# Altium schematic sheet CPU.SchDoc
size A4
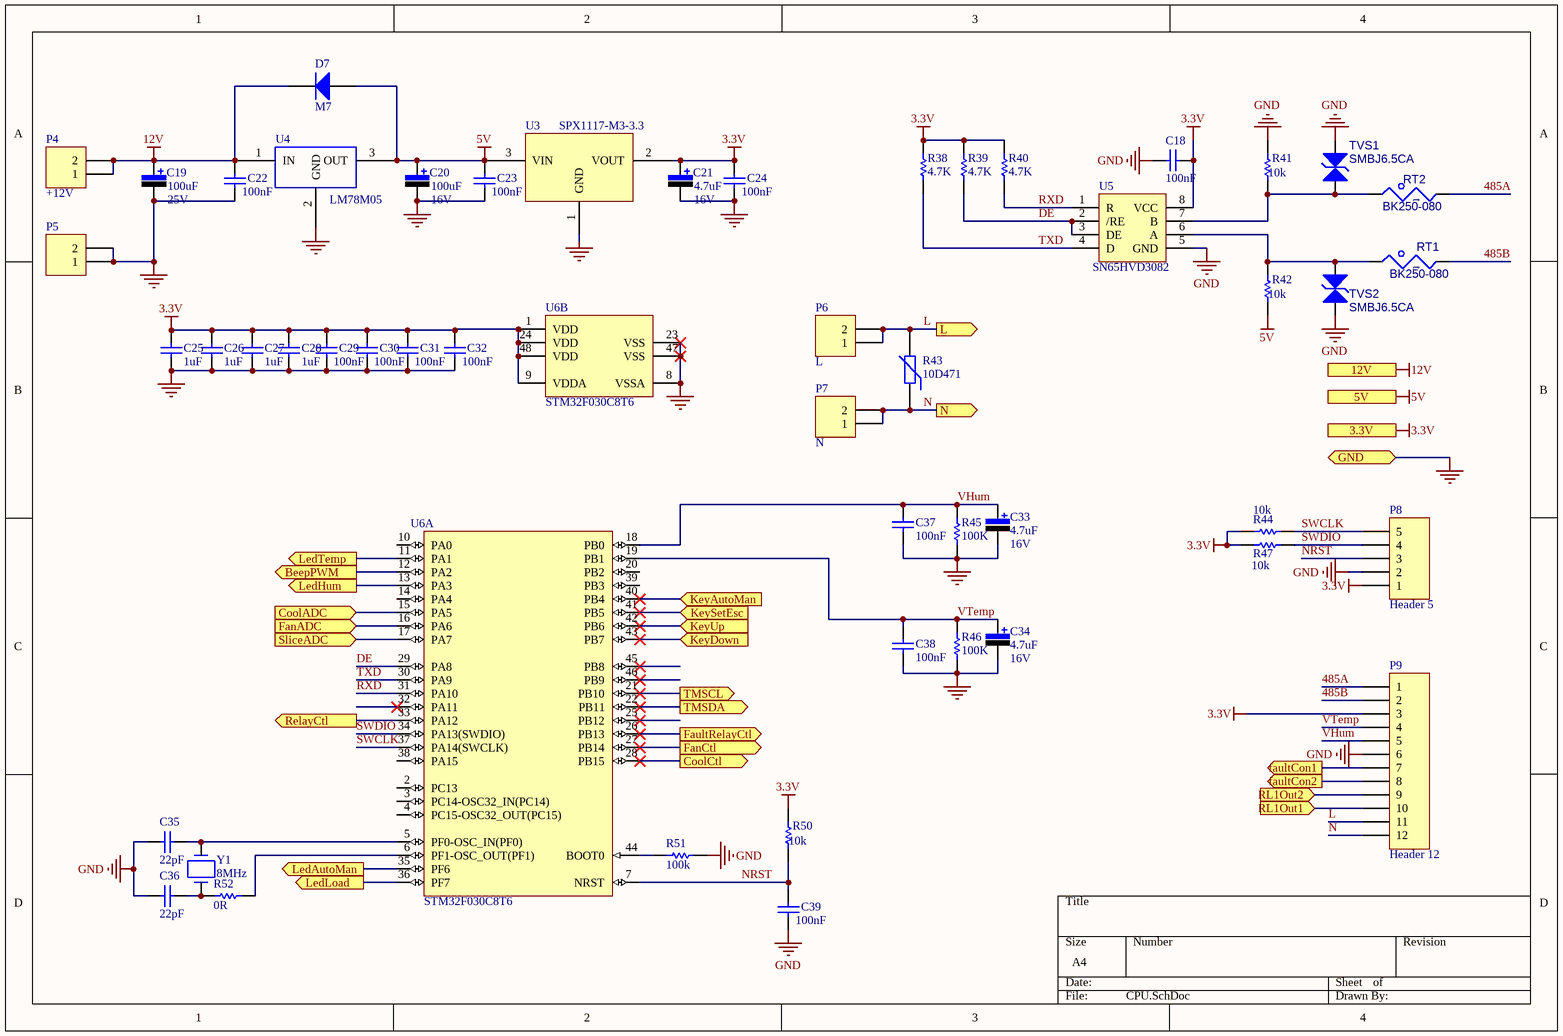
[diagram p0: CPU.SchDoc]

## Parts
C18  100nF (104) 10% 50V  [0603_C]  (value not drawn)
C19  value 100uF  Vol: 25V  [C-RB-8]  (hidden comment: 100uF/25V)
C20  value 100uF  Vol: 16V  [C-RB-8]  (hidden comment: 100uF/16V)
C21  value 4.7uF  Vol: 16V  [CAP-1206]  (hidden comment: 4.7uF/16V)
C22  100nF (104) 10% 50V  [0603_C]  (value not drawn)
C23  100nF (104) 10% 50V  [0603_C]  (value not drawn)
C24  100nF (104) 10% 50V  [0603_C]  (value not drawn)
C25  1uF (105) 10% 50V  [0603_C]  (value not drawn)
C26  1uF (105) 10% 50V  [0603_C]  (value not drawn)
C27  1uF (105) 10% 50V  [0603_C]  (value not drawn)
C28  1uF (105) 10% 50V  [0603_C]  (value not drawn)
C29  100nF (104) 10% 50V  [0603_C]  (value not drawn)
C30  100nF (104) 10% 50V  [0603_C]  (value not drawn)
C31  100nF (104) 10% 50V  [0603_C]  (value not drawn)
C32  100nF (104) 10% 50V  [0603_C]  (value not drawn)
C33  value 4.7uF  Vol: 16V  [CAP-1206]  (hidden comment: 4.7uF/16V)
C34  value 4.7uF  Vol: 16V  [CAP-1206]  (hidden comment: 4.7uF/16V)
C35  22pF (220) 5% 50V  [0603_C]  (value not drawn)
C36  22pF (220) 5% 50V  [0603_C]  (value not drawn)
C37  100nF (104) 10% 50V  [0603_C]  (value not drawn)
C38  100nF (104) 10% 50V  [0603_C]  (value not drawn)
C39  100nF (104) 10% 50V  [0603_C]  (value not drawn)
D7  M7  [DO214AC-SMA]
P4  +12V  [ConSlice0.5]
P5  (no value)  [ConSlice0.5]
P6  L  [ConSlice0.5]
P7  N  [ConSlice0.5]
P8  Header 5  [HDR1X5]
P9  Header 12  [HDR3.5-12P_1]
R38  4.7K  [RESC1608N-R0603]
R39  4.7K  [RESC1608N-R0603]
R40  4.7K  [RESC1608N-R0603]
R41  10k  [RESC1608N-R0603]
R42  10k  [RESC1608N-R0603]
R43  10D471  [10D471K]
R44  10k  [RESC1608N-R0603]
R45  100K  [RESC1608N-R0603]
R46  100K  [RESC1608N-R0603]
R47  10k  [RESC1608N-R0603]
R50  10k  [RESC1608N-R0603]
R51  100k  [RESC1608N-R0603]
R52  0R  [RESC1608N-R0603]
RT1  BK250-080  [RAD0.2]
RT2  BK250-080  [RAD0.2]
TVS1  SMBJ6.5CA  [1812]
TVS2  SMBJ6.5CA  [1812]
U3  SPX1117-M3-3.3  [SOT223]
U4  LM78M05  [DPAK]
U5  SN65HVD3082  [SO-8]
U6  STM32F030C8T6  [STM-LQFP48_N]  (parts A,B of 2)
Y1  8MHz  [HC49S_th]

## Ports
3.3V (out), 5V (out), 12V (out), BeepPWM (out), CoolADC (in), CoolCtl (out), FanADC (in), FanCtl (out), faultCon1 (out), faultCon2 (out), FaultRelayCtl (out), GND (bidir), KeyAutoMan (in), KeyDown (in), KeySetEsc (in), KeyUp (in), L (out), LedAutoMan (out), LedHum (out), LedLoad (out), LedTemp (out), N (out), RelayCtl (out), RL1Out1 (in), RL1Out2 (in), SliceADC (in), TMSCL (out), TMSDA (out)

## Nets
3.3V: C18.1 C21.1 C24.2 C25.2 C26.2 C27.2 C28.2 C29.2 C30.2 C31.2 C32.2 P8.1 P9.3 R38.1 R39.1 R40.1 R44.1 R47.1 R50.1 U3.2(VOUT) U5.8(VCC) U6.1(VDD) U6.9(VDDA) U6.24(VDD) U6.48(VDD) ; port 3.3V
5V: C20.1 C23.2 D7.1(A) R42.2 U3.3(VIN) U4.3(OUT) ; port 5V
12V: C19.1 C22.2 D7.2(K) P4.1 P4.2 U4.1(IN) ; port 12V
GND: C18.2 C19.2 C20.2 C21.2 C22.1 C23.1 C24.1 C25.1 C26.1 C27.1 C28.1 C29.1 C30.1 C31.1 C32.1 C33.2 C34.2 C35.2 C36.2 C37.1 C38.1 C39.1 P5.1 P5.2 P8.2 P9.6 R41.1 R45.2 R46.2 R51.2 TVS1.1(A) TVS2.2(K) U3.1(GND) U4.2(GND) U5.5(GND) U6.8(VSSA) U6.23(VSS) U6.47(VSS) ; port GND
485A: P9.1 RT2.1
485B: P9.2 RT1.1
BeepPWM: U6.12(PA2) ; port BeepPWM
CoolADC: U6.15(PA5) ; port CoolADC
CoolCtl: U6.28(PB15) ; port CoolCtl
DE: R39.2 U5.2(/RE) U5.3(DE) U6.29(PA8)
FanADC: U6.16(PA6) ; port FanADC
FanCtl: U6.27(PB14) ; port FanCtl
faultCon1: P9.7 ; port faultCon1
faultCon2: P9.8 ; port faultCon2
FaultRelayCtl: U6.26(PB13) ; port FaultRelayCtl
KeyAutoMan: U6.40(PB4) ; port KeyAutoMan
KeyDown: U6.43(PB7) ; port KeyDown
KeySetEsc: U6.41(PB5) ; port KeySetEsc
KeyUp: U6.42(PB6) ; port KeyUp
L: P6.1 P6.2 P9.11 R43.2 ; port L
LedAutoMan: U6.35(PF6) ; port LedAutoMan
LedHum: U6.13(PA3) ; port LedHum
LedLoad: U6.36(PF7) ; port LedLoad
LedTemp: U6.11(PA1) ; port LedTemp
N: P7.1 P7.2 P9.12 R43.1 ; port N
NRST: C39.2 P8.3 R50.2 U6.7(NRST)
RelayCtl: U6.33(PA12) ; port RelayCtl
RL1Out1: P9.10 ; port RL1Out1
RL1Out2: P9.9 ; port RL1Out2
RXD: R40.2 U5.1(R) U6.31(PA10)
SliceADC: U6.17(PA7) ; port SliceADC
SWCLK: P8.5 R44.2 U6.37(PA14(SWCLK))
SWDIO: P8.4 R47.2 U6.34(PA13(SWDIO))
TMSCL: U6.21(PB10) ; port TMSCL
TMSDA: U6.22(PB11) ; port TMSDA
TXD: R38.2 U5.4(D) U6.30(PA9)
VHum: C33.1 C37.2 P9.5 R45.1 U6.18(PB0)
VTemp: C34.1 C38.2 P9.4 R46.1 U6.19(PB1)
NetC35_1: C35.1 U6.5(PF0-OSC_IN(PF0)) Y1.1
NetC36_1: C36.1 R52.2 Y1.2
NetR41_2: R41.2 RT2.2 TVS1.2(K) U5.7(B)
NetR42_1: R42.1 RT1.2 TVS2.1(A) U5.6(A)
NetR51_1: R51.1 U6.44(BOOT0)
NetR52_1: R52.1 U6.6(PF1-OSC_OUT(PF1))

Not connected (* = marked no-connect by the designer): U6 2(PC13) 3(PC14-OSC32_IN(PC14)) 4(PC15-OSC32_OUT(PC15)) 10(PA0) 14(PA4) 20(PB2) 25(PB12)* 32(PA11)* 38(PA15) 39(PB3) 45(PB8)* 46(PB9)*

## Notes on the sheet
- (in symbol 0603 1uF (105) 10% 50V) 1uF
- (in symbol 0603 22pF (220) 5% 50V) 22pF
- (in symbol 0603 100nF (104) 10% 50V) 100nF
- (in symbol PTC-Thermistor) t

## Library data of the parts
C18 C22-C24 C29-C32 C37-C39 = 0603 100nF (104) 10% 50V: 贴片电容; ComponentLink1Description: 供应商链接; ComponentLink1URL: http://www.szlcsc.com/product/details_15331.html; Package: 0603; Supplier: LC; SuppliersPartNumber: C14663
C19 C20 = Cap Pol: Published: 8-Jun-2000; LatestRevisionDate: 17-Jul-2002; LatestRevisionNote: Re-released for DXP Platform.; PackageReference: RB7.6-15; Publisher: Altium Limited
C21 C33 C34 = Cap Pol: 4.7uF/16V钽电容; Published: 8-Jun-2000; LatestRevisionDate: 17-Jul-2002; LatestRevisionNote: Re-released for DXP Platform.; PackageReference: RB7.6-15; Publisher: Altium Limited
C25-C28 = 0603 1uF (105) 10% 50V: 贴片电容; ComponentLink1Description: 供应商链接; ComponentLink1URL: http://www.szlcsc.com/product/details_16531.html; Package: 0603; Supplier: LC; SuppliersPartNumber: C15849
C35 C36 = 0603 22pF (220) 5% 50V: 贴片电容; ComponentLink1Description: 供应商链接; ComponentLink1URL: http://www.szlcsc.com/product/details_2005.html; Package: 0603; Supplier: LC; SuppliersPartNumber: C1653
D7 = Diode: 二极管; Published: 8-Jun-2000; LatestRevisionDate: 17-Jul-2002; LatestRevisionNote: Re-released for DXP Platform.; PackageDocument: Sep-1996; PackageReference: SMC; Publisher: Altium Limited; Code_JEDEC: DO-214-AB; Type: M7
P4-P7 = Header 2: Header, 2-Pin; LatestRevisionDate: 17-Jul-2002; LatestRevisionNote: Re-released for DXP Platform.; Publisher: Altium Limited
P8 = Header 5: Header, 5-Pin; LatestRevisionDate: 17-Jul-2002; LatestRevisionNote: Re-released for DXP Platform.; Publisher: Altium Limited
P9 = Header 12: Header, 12-Pin; LatestRevisionDate: 17-Jul-2002; LatestRevisionNote: Re-released for DXP Platform.; Publisher: Altium Limited
R38-R40 = RES1: 4.7K/±10%; 零件名称: 贴片电阻
R41 R42 R44 R47 R50 = RES1: 10k/±10%; 零件名称: 贴片电阻
R43 = Res Varistor: Varistor (Voltage-Sensitive Resistor); Published: 24-Mar-1999; LatestRevisionDate: 29-May-2009; LatestRevisionNote: IPC-7351 Footprint Added.; PackageVersion: Mar-2003; PackageReference: 6-0805; Publisher: Altium Limited; PackageDescription: Chip Resistor 0805 Case Size; Code_IPC: RESC2012
R45 R46 R51 = RES1: 100K/±10%; 零件名称: 贴片电阻
R52 = RES1: 0R±10%; 零件名称: 贴片电阻
RT1 RT2 = PTC-Thermistor: 热敏电阻
TVS1 TVS2 = TVS管-贴片: TVS
U3 = IC-SPX1117M3-L-3.3 工业级 SOT-223 SIPEX: U_TABLE: U_IC; LH: I03-011173-601; U_ITEM_ID（U_ITEM_ID）: Part00003063; U_OBJECT_NAME（U_OBJECT_NAME）: 芯片; U_1002（U_1002）: SIPEX; U_200003（U_200003）: 工业级; U_CL2_ITEMM_00（U_CL2_ITEMM_00）: I03-011173-601; U_CL2_ITEMR_00（U_CL2_ITEMR_00）: SPX1117M3-L-3.3 工业级 SOT-223 SIPEX; U_200002（U_200002）: SPX1117M3-L-3.3; U_200004（U_200004）: SOT-223
U4 = LDO-78XX_1: PART CODE: ?
U5 = RS485
U6 = STM32F030C8T6: Core: ARM Cortex-M0; FLASH Size (Prog) (kB): 64; I/Os (High Current): 39; Internal RAM Size (kB): 8; Operating Frequency(F) (Processor speed) (MHz): 48; Packing: Tray; Supply Voltage(Vcc) min (V): 2.4; DatasheetVersion: Rev. 1; PackageVersion: Rev. 6, 06/2013; PackageReference: LQFP48; PackageDescription: 48-Pin Low Profile Quad Flat Package, 7 x 7 mm Body, 0.5 mm Pitch; Supplier 1: Digi-Key; Supplier Part Number 1: 497-14043-ND; Supplier 2: Newark; Supplier Part Number 2: 06X3647; Supplier 3: Mouser; Supplier Part Number 3: 511-STM32F030C8T6; Mounting Technology: Surface Mount; PartNumber: STM32F030C8T6; ComponentLink1Description: Manufacturer URL; ComponentLink1URL: http://www.st.com/web/en/home.html; ComponentLink2Description: Datasheet; ComponentLink2URL: http://www.st.com/st-web-ui/static/active/en/resource/technical/document/datasheet/DM00088500.pdf; ComponentLink3Description: Package Specification; ComponentLink3URL: http://www.st.com/st-web-ui/static/active/en/resource/technical/document/datasheet/DM00058181.pdf
Y1 = RU5608001: QUARTZ 8MHz SMD; Mfr_name1: 2B-ELETTRONICA; Mfr_Part_Number1: TP0871/F; Part_type: QUARTZ\SMD; Prepared: BONOMI P.; Approved: MANZOLI R.; RU_code: RU5608001; PackageID: RU5608001; Valore: 8MHz; Case_size: SMD; Datasheet: K:\ORCAD CAPTURE CIS DATABASE\DATASHEET\QUARTZ_RESONATOR; Make_date: L2587_DT; Last_rev_date: L3084_DT; RoHs: True; Export_Control: N.A.